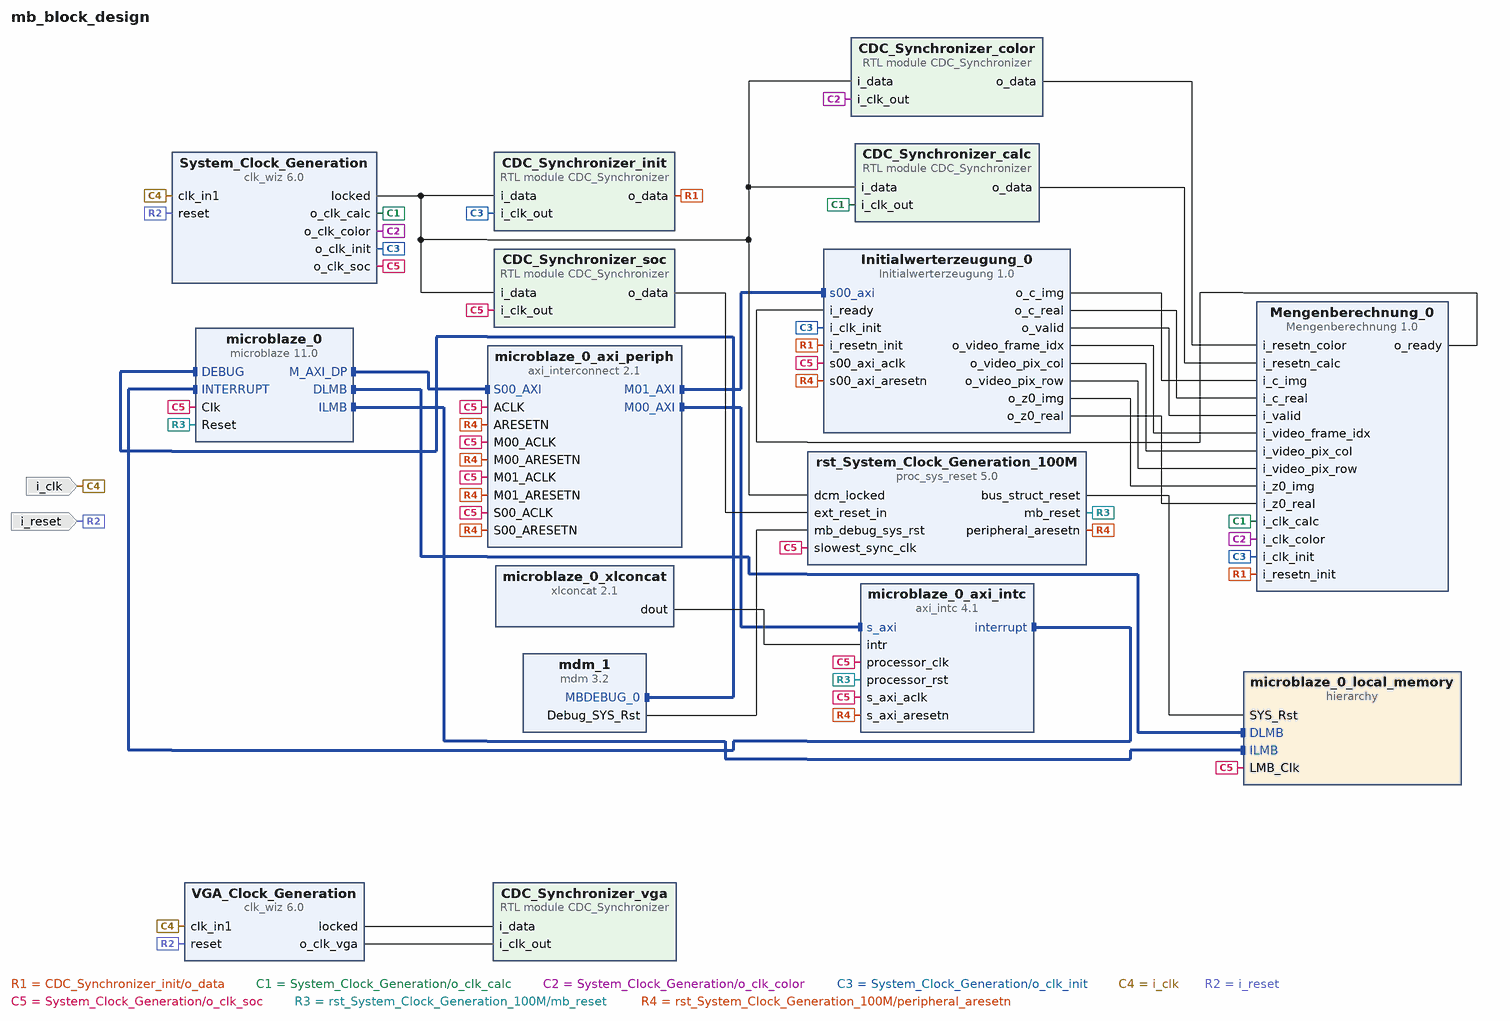
[diagram p0: block diagram of the top level]
# Vivado block design mb_block_design, xc7a100tcsg324-1, Vivado 2023.2
create_bd_design mb_block_design

create_bd_port -dir I -type rst i_reset
set_property -dict {CONFIG.POLARITY ACTIVE_HIGH} [get_bd_ports i_reset]
create_bd_port -dir I -type clk i_clk
set_property -dict {CONFIG.FREQ_HZ 100000000} [get_bd_ports i_clk]

create_bd_cell -type ip -vlnv user.org:user:Mengenberechnung:1.0 Mengenberechnung_0
create_bd_cell -type ip -vlnv xilinx.com:ip:clk_wiz:6.0 System_Clock_Generation
set_property -dict [list \
  CONFIG.CLKOUT1_DRIVES BUFG \
  CONFIG.CLKOUT1_JITTER 151.636 \
  CONFIG.CLKOUT1_PHASE_ERROR 98.575 \
  CONFIG.CLKOUT1_REQUESTED_OUT_FREQ 50.000 \
  CONFIG.CLKOUT2_DRIVES BUFG \
  CONFIG.CLKOUT2_JITTER 130.958 \
  CONFIG.CLKOUT2_PHASE_ERROR 98.575 \
  CONFIG.CLKOUT2_USED true \
  CONFIG.CLKOUT3_DRIVES BUFG \
  CONFIG.CLKOUT3_JITTER 151.636 \
  CONFIG.CLKOUT3_PHASE_ERROR 98.575 \
  CONFIG.CLKOUT3_REQUESTED_OUT_FREQ 50.000 \
  CONFIG.CLKOUT3_USED true \
  CONFIG.CLKOUT4_DRIVES BUFG \
  CONFIG.CLKOUT4_JITTER 130.958 \
  CONFIG.CLKOUT4_PHASE_ERROR 98.575 \
  CONFIG.CLKOUT4_REQUESTED_OUT_FREQ 100.000 \
  CONFIG.CLKOUT4_USED true \
  CONFIG.CLKOUT5_DRIVES BUFG \
  CONFIG.CLKOUT5_JITTER 130.958 \
  CONFIG.CLKOUT5_PHASE_ERROR 98.575 \
  CONFIG.CLKOUT5_USED false \
  CONFIG.CLKOUT6_DRIVES BUFG \
  CONFIG.CLKOUT6_JITTER 130.958 \
  CONFIG.CLKOUT6_PHASE_ERROR 98.575 \
  CONFIG.CLKOUT6_USED false \
  CONFIG.CLKOUT7_DRIVES BUFG \
  CONFIG.CLK_OUT1_PORT o_clk_init \
  CONFIG.CLK_OUT2_PORT o_clk_calc \
  CONFIG.CLK_OUT3_PORT o_clk_color \
  CONFIG.CLK_OUT4_PORT o_clk_soc \
  CONFIG.CLK_OUT5_PORT o_clk_blaze \
  CONFIG.CLK_OUT6_PORT o_clk_axi \
  CONFIG.FEEDBACK_SOURCE FDBK_AUTO \
  CONFIG.MMCM_BANDWIDTH OPTIMIZED \
  CONFIG.MMCM_CLKFBOUT_MULT_F 10.000 \
  CONFIG.MMCM_CLKOUT0_DIVIDE_F 20.000 \
  CONFIG.MMCM_CLKOUT1_DIVIDE 10 \
  CONFIG.MMCM_CLKOUT2_DIVIDE 20 \
  CONFIG.MMCM_CLKOUT3_DIVIDE 10 \
  CONFIG.MMCM_CLKOUT4_DIVIDE 1 \
  CONFIG.MMCM_CLKOUT5_DIVIDE 1 \
  CONFIG.MMCM_COMPENSATION ZHOLD \
  CONFIG.NUM_OUT_CLKS 4 \
  CONFIG.PRIMITIVE MMCM \
] [get_bd_cells System_Clock_Generation]
create_bd_cell -type ip -vlnv xilinx.com:ip:clk_wiz:6.0 VGA_Clock_Generation
set_property -dict [list \
  CONFIG.CLKOUT1_JITTER 319.783 \
  CONFIG.CLKOUT1_PHASE_ERROR 246.739 \
  CONFIG.CLKOUT1_REQUESTED_OUT_FREQ 25.175 \
  CONFIG.CLK_OUT1_PORT o_clk_vga \
  CONFIG.MMCM_CLKFBOUT_MULT_F 36.375 \
  CONFIG.MMCM_CLKOUT0_DIVIDE_F 36.125 \
  CONFIG.MMCM_DIVCLK_DIVIDE 4 \
] [get_bd_cells VGA_Clock_Generation]
create_bd_cell -type module -reference CDC_Synchronizer CDC_Synchronizer_init
create_bd_cell -type module -reference CDC_Synchronizer CDC_Synchronizer_calc
create_bd_cell -type module -reference CDC_Synchronizer CDC_Synchronizer_color
create_bd_cell -type module -reference CDC_Synchronizer CDC_Synchronizer_vga
create_bd_cell -type module -reference CDC_Synchronizer CDC_Synchronizer_soc
create_bd_cell -type ip -vlnv xilinx.com:ip:microblaze:11.0 microblaze_0
set_property -dict {CONFIG.C_DEBUG_ENABLED 1 CONFIG.C_D_AXI 1 CONFIG.C_D_LMB 1 CONFIG.C_I_LMB 1} [get_bd_cells microblaze_0]
create_bd_cell -type hier microblaze_0_local_memory
create_bd_cell -type ip -vlnv xilinx.com:ip:axi_interconnect:2.1 microblaze_0_axi_periph
set_property -dict {CONFIG.NUM_MI 2} [get_bd_cells microblaze_0_axi_periph]
create_bd_cell -type ip -vlnv xilinx.com:ip:axi_intc:4.1 microblaze_0_axi_intc
set_property -dict {CONFIG.C_HAS_FAST 1} [get_bd_cells microblaze_0_axi_intc]
create_bd_cell -type ip -vlnv xilinx.com:ip:xlconcat:2.1 microblaze_0_xlconcat
create_bd_cell -type ip -vlnv xilinx.com:ip:mdm:3.2 mdm_1
create_bd_cell -type ip -vlnv xilinx.com:ip:proc_sys_reset:5.0 rst_System_Clock_Generation_100M
create_bd_cell -type ip -vlnv user.org:user:Initialwerterzeugung:1.0 Initialwerterzeugung_0

# ---- hierarchy /microblaze_0_local_memory ----
current_bd_instance /microblaze_0_local_memory
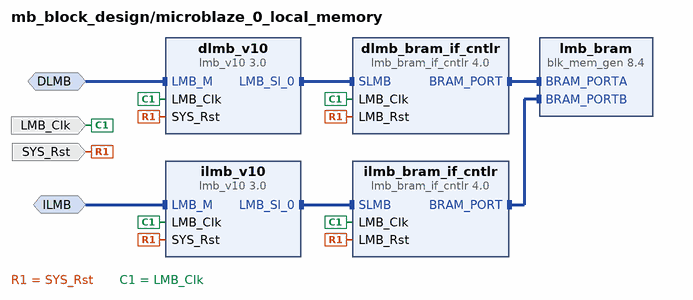
[diagram p1: block diagram inside /microblaze_0_local_memory]
create_bd_intf_pin -mode MirroredMaster -vlnv xilinx.com:interface:lmb_rtl:1.0 DLMB
create_bd_intf_pin -mode MirroredMaster -vlnv xilinx.com:interface:lmb_rtl:1.0 ILMB
create_bd_pin -dir I -type clk LMB_Clk
create_bd_pin -dir I -type rst SYS_Rst

create_bd_cell -type ip -vlnv xilinx.com:ip:lmb_v10:3.0 dlmb_v10
create_bd_cell -type ip -vlnv xilinx.com:ip:lmb_v10:3.0 ilmb_v10
create_bd_cell -type ip -vlnv xilinx.com:ip:lmb_bram_if_cntlr:4.0 dlmb_bram_if_cntlr
set_property -dict {CONFIG.C_ECC 0} [get_bd_cells dlmb_bram_if_cntlr]
create_bd_cell -type ip -vlnv xilinx.com:ip:lmb_bram_if_cntlr:4.0 ilmb_bram_if_cntlr
set_property -dict {CONFIG.C_ECC 0} [get_bd_cells ilmb_bram_if_cntlr]
create_bd_cell -type ip -vlnv xilinx.com:ip:blk_mem_gen:8.4 lmb_bram
set_property -dict {CONFIG.Memory_Type True_Dual_Port_RAM CONFIG.use_bram_block BRAM_Controller} [get_bd_cells lmb_bram]

# ---- connections ----

current_bd_instance /microblaze_0_local_memory
connect_bd_intf_net -intf_net microblaze_0_dlmb [get_bd_intf_pins dlmb_v10/LMB_M] [get_bd_intf_pins DLMB]
connect_bd_intf_net -intf_net microblaze_0_dlmb_bus [get_bd_intf_pins dlmb_v10/LMB_Sl_0] [get_bd_intf_pins dlmb_bram_if_cntlr/SLMB]
connect_bd_intf_net -intf_net microblaze_0_dlmb_cntlr [get_bd_intf_pins dlmb_bram_if_cntlr/BRAM_PORT] [get_bd_intf_pins lmb_bram/BRAM_PORTA]
connect_bd_intf_net -intf_net microblaze_0_ilmb [get_bd_intf_pins ilmb_v10/LMB_M] [get_bd_intf_pins ILMB]
connect_bd_intf_net -intf_net microblaze_0_ilmb_bus [get_bd_intf_pins ilmb_v10/LMB_Sl_0] [get_bd_intf_pins ilmb_bram_if_cntlr/SLMB]
connect_bd_intf_net -intf_net microblaze_0_ilmb_cntlr [get_bd_intf_pins ilmb_bram_if_cntlr/BRAM_PORT] [get_bd_intf_pins lmb_bram/BRAM_PORTB]
connect_bd_net [get_bd_pins SYS_Rst] \
  [get_bd_pins dlmb_v10/SYS_Rst] [get_bd_pins dlmb_bram_if_cntlr/LMB_Rst] [get_bd_pins ilmb_v10/SYS_Rst] \
  [get_bd_pins ilmb_bram_if_cntlr/LMB_Rst]
connect_bd_net -net microblaze_0_Clk [get_bd_pins LMB_Clk] \
  [get_bd_pins dlmb_v10/LMB_Clk] [get_bd_pins dlmb_bram_if_cntlr/LMB_Clk] [get_bd_pins ilmb_v10/LMB_Clk] \
  [get_bd_pins ilmb_bram_if_cntlr/LMB_Clk]
set_property HDL_ATTRIBUTE.BMM_INFO_ADDRESS_SPACE {byte  0x00000000 32 > mb_block_design microblaze_0_local_memory/lmb_bram} [get_bd_cells dlmb_bram_if_cntlr]
set_property HDL_ATTRIBUTE.KEEP_HIERARCHY yes [get_bd_cells dlmb_bram_if_cntlr]

current_bd_instance /
connect_bd_intf_net -intf_net microblaze_0_axi_dp [get_bd_intf_pins microblaze_0_axi_periph/S00_AXI] [get_bd_intf_pins microblaze_0/M_AXI_DP]
connect_bd_intf_net [get_bd_intf_pins microblaze_0_axi_periph/M01_AXI] [get_bd_intf_pins Initialwerterzeugung_0/s00_axi]
connect_bd_intf_net [get_bd_intf_pins mdm_1/MBDEBUG_0] [get_bd_intf_pins microblaze_0/DEBUG]
connect_bd_intf_net [get_bd_intf_pins microblaze_0/DLMB] [get_bd_intf_pins microblaze_0_local_memory/DLMB]
connect_bd_intf_net [get_bd_intf_pins microblaze_0/ILMB] [get_bd_intf_pins microblaze_0_local_memory/ILMB]
connect_bd_intf_net -intf_net microblaze_0_intc_axi [get_bd_intf_pins microblaze_0_axi_periph/M00_AXI] [get_bd_intf_pins microblaze_0_axi_intc/s_axi]
connect_bd_intf_net [get_bd_intf_pins microblaze_0_axi_intc/interrupt] [get_bd_intf_pins microblaze_0/INTERRUPT]
connect_bd_net [get_bd_pins CDC_Synchronizer_calc/o_data] [get_bd_pins Mengenberechnung_0/i_resetn_calc]
connect_bd_net [get_bd_pins CDC_Synchronizer_color/o_data] [get_bd_pins Mengenberechnung_0/i_resetn_color]
connect_bd_net [get_bd_pins CDC_Synchronizer_init/o_data] \
  [get_bd_pins Mengenberechnung_0/i_resetn_init] [get_bd_pins Initialwerterzeugung_0/i_resetn_init]
connect_bd_net [get_bd_pins CDC_Synchronizer_soc/o_data] [get_bd_pins rst_System_Clock_Generation_100M/ext_reset_in]
connect_bd_net [get_bd_pins Initialwerterzeugung_0/o_c_img] [get_bd_pins Mengenberechnung_0/i_c_img]
connect_bd_net [get_bd_pins Initialwerterzeugung_0/o_c_real] [get_bd_pins Mengenberechnung_0/i_c_real]
connect_bd_net [get_bd_pins Initialwerterzeugung_0/o_valid] [get_bd_pins Mengenberechnung_0/i_valid]
connect_bd_net [get_bd_pins Initialwerterzeugung_0/o_video_frame_idx] [get_bd_pins Mengenberechnung_0/i_video_frame_idx]
connect_bd_net [get_bd_pins Initialwerterzeugung_0/o_video_pix_col] [get_bd_pins Mengenberechnung_0/i_video_pix_col]
connect_bd_net [get_bd_pins Initialwerterzeugung_0/o_video_pix_row] [get_bd_pins Mengenberechnung_0/i_video_pix_row]
connect_bd_net [get_bd_pins Initialwerterzeugung_0/o_z0_img] [get_bd_pins Mengenberechnung_0/i_z0_img]
connect_bd_net [get_bd_pins Initialwerterzeugung_0/o_z0_real] [get_bd_pins Mengenberechnung_0/i_z0_real]
connect_bd_net [get_bd_pins Mengenberechnung_0/o_ready] [get_bd_pins Initialwerterzeugung_0/i_ready]
connect_bd_net [get_bd_pins System_Clock_Generation/locked] \
  [get_bd_pins CDC_Synchronizer_init/i_data] [get_bd_pins CDC_Synchronizer_calc/i_data] \
  [get_bd_pins CDC_Synchronizer_color/i_data] [get_bd_pins CDC_Synchronizer_soc/i_data] \
  [get_bd_pins rst_System_Clock_Generation_100M/dcm_locked]
connect_bd_net [get_bd_pins System_Clock_Generation/o_clk_calc] \
  [get_bd_pins Mengenberechnung_0/i_clk_calc] [get_bd_pins CDC_Synchronizer_calc/i_clk_out]
connect_bd_net [get_bd_pins System_Clock_Generation/o_clk_color] \
  [get_bd_pins Mengenberechnung_0/i_clk_color] [get_bd_pins CDC_Synchronizer_color/i_clk_out]
connect_bd_net [get_bd_pins System_Clock_Generation/o_clk_init] \
  [get_bd_pins Mengenberechnung_0/i_clk_init] [get_bd_pins CDC_Synchronizer_init/i_clk_out] \
  [get_bd_pins Initialwerterzeugung_0/i_clk_init]
connect_bd_net -net VGA_Clock_Generation_0_locked [get_bd_pins VGA_Clock_Generation/locked] [get_bd_pins CDC_Synchronizer_vga/i_data]
connect_bd_net -net VGA_Clock_Generation_0_o_clk_vga [get_bd_pins VGA_Clock_Generation/o_clk_vga] [get_bd_pins CDC_Synchronizer_vga/i_clk_out]
connect_bd_net [get_bd_ports i_clk] [get_bd_pins System_Clock_Generation/clk_in1] [get_bd_pins VGA_Clock_Generation/clk_in1]
connect_bd_net [get_bd_ports i_reset] [get_bd_pins System_Clock_Generation/reset] [get_bd_pins VGA_Clock_Generation/reset]
connect_bd_net [get_bd_pins mdm_1/Debug_SYS_Rst] [get_bd_pins rst_System_Clock_Generation_100M/mb_debug_sys_rst]
connect_bd_net -net microblaze_0_Clk [get_bd_pins System_Clock_Generation/o_clk_soc] \
  [get_bd_pins CDC_Synchronizer_soc/i_clk_out] [get_bd_pins microblaze_0/Clk] [get_bd_pins microblaze_0_axi_periph/ACLK] \
  [get_bd_pins microblaze_0_axi_periph/S00_ACLK] [get_bd_pins microblaze_0_axi_periph/M00_ACLK] \
  [get_bd_pins microblaze_0_axi_intc/s_axi_aclk] [get_bd_pins microblaze_0_axi_intc/processor_clk] \
  [get_bd_pins microblaze_0_local_memory/LMB_Clk] [get_bd_pins rst_System_Clock_Generation_100M/slowest_sync_clk] \
  [get_bd_pins Initialwerterzeugung_0/s00_axi_aclk] [get_bd_pins microblaze_0_axi_periph/M01_ACLK]
connect_bd_net -net microblaze_0_intr [get_bd_pins microblaze_0_xlconcat/dout] [get_bd_pins microblaze_0_axi_intc/intr]
connect_bd_net [get_bd_pins rst_System_Clock_Generation_100M/bus_struct_reset] [get_bd_pins microblaze_0_local_memory/SYS_Rst]
connect_bd_net [get_bd_pins rst_System_Clock_Generation_100M/mb_reset] \
  [get_bd_pins microblaze_0/Reset] [get_bd_pins microblaze_0_axi_intc/processor_rst]
connect_bd_net [get_bd_pins rst_System_Clock_Generation_100M/peripheral_aresetn] \
  [get_bd_pins microblaze_0_axi_periph/ARESETN] [get_bd_pins microblaze_0_axi_periph/S00_ARESETN] \
  [get_bd_pins microblaze_0_axi_periph/M00_ARESETN] [get_bd_pins microblaze_0_axi_intc/s_axi_aresetn] \
  [get_bd_pins Initialwerterzeugung_0/s00_axi_aresetn] [get_bd_pins microblaze_0_axi_periph/M01_ARESETN]
set_property HDL_ATTRIBUTE.BMM_INFO_PROCESSOR {microblaze-le > mb_block_design microblaze_0_local_memory/dlmb_bram_if_cntlr} [get_bd_cells microblaze_0]
set_property HDL_ATTRIBUTE.KEEP_HIERARCHY yes [get_bd_cells microblaze_0]

# ---- address map ----
assign_bd_address -offset 0x00000000 -range 32K -target_address_space [get_bd_addr_spaces microblaze_0/Data] [get_bd_addr_segs microblaze_0_local_memory/dlmb_bram_if_cntlr/SLMB/Mem]
assign_bd_address -offset 0x00010000 -range 4K -target_address_space [get_bd_addr_spaces microblaze_0/Data] [get_bd_addr_segs Initialwerterzeugung_0/s00_axi/reg0]
assign_bd_address -offset 0x41200000 -range 64K -target_address_space [get_bd_addr_spaces microblaze_0/Data] [get_bd_addr_segs microblaze_0_axi_intc/S_AXI/Reg]
assign_bd_address -offset 0x00000000 -range 32K -target_address_space [get_bd_addr_spaces microblaze_0/Instruction] [get_bd_addr_segs microblaze_0_local_memory/ilmb_bram_if_cntlr/SLMB/Mem]

validate_bd_design
save_bd_design
